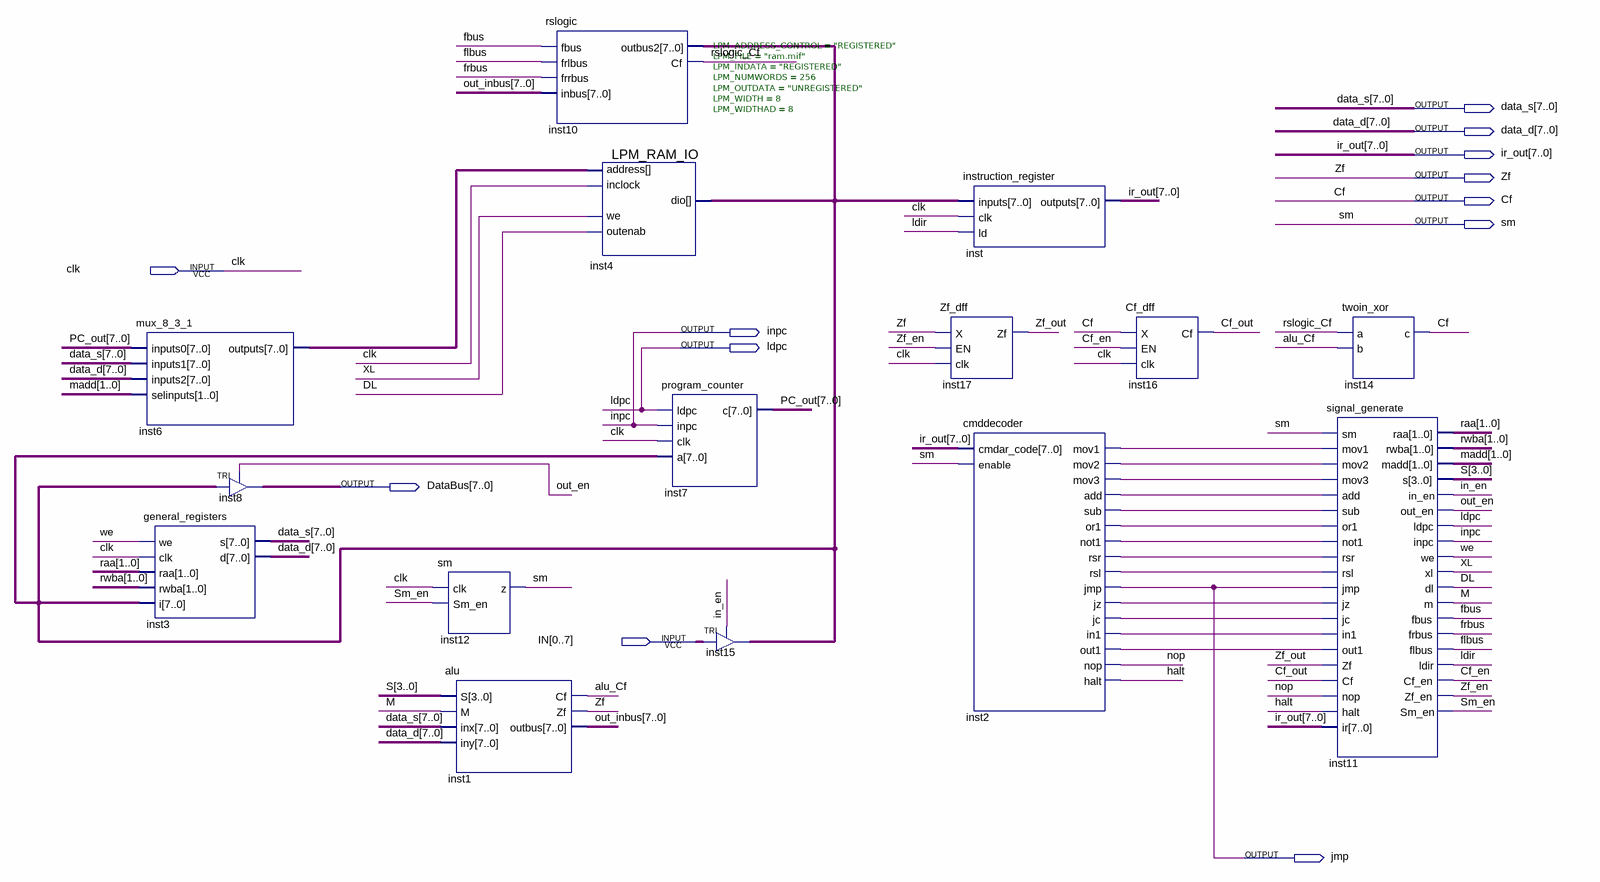
[diagram p0: schematic sheet]
// Quartus schematic CPU.bdf as structural Verilog: 15 symbols, 12 pins
module CPU (
  input  clk,
  input  [0:7] IN,
  output [7:0] data_s,
  output [7:0] data_d,
  output [7:0] ir_out,
  output Zf,
  output Cf,
  output sm,
  output inpc,
  output ldpc,
  output [7:0] DataBus,
  output jmp
);

  wire alu_Cf, Cf_en, Cf_out, DL, fbus, flbus, frbus, halt, in_en, inst2_add, inst2_in1, inst2_jc, inst2_jz,
       inst2_mov1, inst2_mov2, inst2_mov3, inst2_not1, inst2_or1, inst2_out1, inst2_rsl, inst2_rsr,
       inst2_sub, ldir, M, nop, out_en, rslogic_Cf, Sm_en, we, XL, Zf_en, Zf_out;
  wire [1:0] madd, raa, rwba;
  wire [3:0] S;
  wire [7:0] inst6_outputs, inst10_outbus2, out_inbus, PC_out;

  mux_8_3_1 inst6 (.inputs0(PC_out), .inputs1(data_s), .inputs2(data_d), .selinputs(madd), .outputs(inst6_outputs));
  general_registers inst3 (.we(we), .clk(clk), .raa(raa), .rwba(rwba), .i(inst10_outbus2), .s(data_s), .d(data_d));
  TRI inst8[7:0] (.IN(inst10_outbus2), .OE(out_en), .OUT(DataBus));
  sm inst12 (.clk(clk), .Sm_en(Sm_en), .z(sm));
  alu inst1 (.S(S), .M(M), .inx(data_s), .iny(data_d), .Cf(alu_Cf), .Zf(Zf), .outbus(out_inbus));
  rslogic inst10 (
    .fbus(fbus), .frlbus(flbus), .frrbus(frbus), .inbus(out_inbus), .outbus2(inst10_outbus2), .Cf(rslogic_Cf));
  LPM_RAM_IO #(.LPM_ADDRESS_CONTROL("REGISTERED"), .LPM_FILE("ram.mif"), .LPM_INDATA("REGISTERED"), .LPM_NUMWORDS(256), .LPM_OUTDATA("UNREGISTERED"), .LPM_WIDTH(8), .LPM_WIDTHAD(8)) inst4 (
    .address(inst6_outputs), .inclock(clk), .we(XL), .outenab(DL), .dio(inst10_outbus2));
  program_counter inst7 (.ldpc(ldpc), .inpc(inpc), .clk(clk), .a(inst10_outbus2), .c(PC_out));
  TRI inst15[7:0] (.IN(IN), .OE(in_en), .OUT(inst10_outbus2));
  Zf_dff inst17 (.X(Zf), .EN(Zf_en), .clk(clk), .Zf(Zf_out));
  instruction_register inst (.inputs(inst10_outbus2), .clk(clk), .ld(ldir), .outputs(ir_out));
  cmddecoder inst2 (
    .cmdar_code(ir_out), .enable(sm), .mov1(inst2_mov1), .mov2(inst2_mov2), .mov3(inst2_mov3),
    .add(inst2_add), .sub(inst2_sub), .or1(inst2_or1), .not1(inst2_not1), .rsr(inst2_rsr), .rsl(inst2_rsl),
    .jmp(jmp), .jz(inst2_jz), .jc(inst2_jc), .in1(inst2_in1), .out1(inst2_out1), .nop(nop), .halt(halt));
  Cf_dff inst16 (.X(Cf), .EN(Cf_en), .clk(clk), .Cf(Cf_out));
  twoin_xor inst14 (.a(rslogic_Cf), .b(alu_Cf), .c(Cf));
  signal_generate inst11 (
    .sm(sm), .mov1(inst2_mov1), .mov2(inst2_mov2), .mov3(inst2_mov3), .add(inst2_add), .sub(inst2_sub),
    .or1(inst2_or1), .not1(inst2_not1), .rsr(inst2_rsr), .rsl(inst2_rsl), .jmp(jmp), .jz(inst2_jz),
    .jc(inst2_jc), .in1(inst2_in1), .out1(inst2_out1), .Zf(Zf_out), .Cf(Cf_out), .nop(nop), .halt(halt),
    .ir(ir_out), .raa(raa), .rwba(rwba), .madd(madd), .s(S), .in_en(in_en), .out_en(out_en), .ldpc(ldpc),
    .inpc(inpc), .we(we), .xl(XL), .dl(DL), .m(M), .fbus(fbus), .frbus(frbus), .flbus(flbus), .ldir(ldir),
    .Cf_en(Cf_en), .Zf_en(Zf_en), .Sm_en(Sm_en));
endmodule
